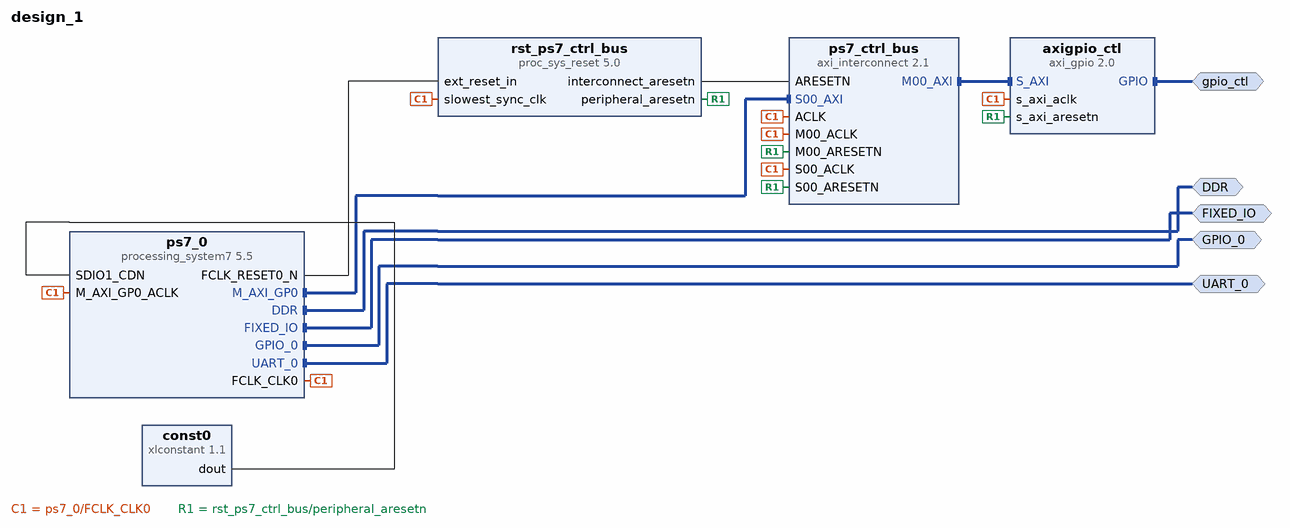
[diagram p0: block diagram of the top level]
# Vivado block design design_1, xc7z010clg400-1, Vivado 2016.4
create_bd_design design_1

create_bd_intf_port -mode Master -vlnv xilinx.com:interface:ddrx_rtl:1.0 DDR
create_bd_intf_port -mode Master -vlnv xilinx.com:display_processing_system7:fixedio_rtl:1.0 FIXED_IO
create_bd_intf_port -mode Master -vlnv xilinx.com:interface:gpio_rtl:1.0 GPIO_0
create_bd_intf_port -mode Master -vlnv xilinx.com:interface:uart_rtl:1.0 UART_0
create_bd_intf_port -mode Master -vlnv xilinx.com:interface:gpio_rtl:1.0 gpio_ctl

create_bd_cell -type ip -vlnv xilinx.com:ip:axi_gpio:2.0 axigpio_ctl
set_property -dict {CONFIG.C_GPIO_WIDTH 2 CONFIG.C_ALL_OUTPUTS 0} [get_bd_cells axigpio_ctl]
create_bd_cell -type ip -vlnv xilinx.com:ip:xlconstant:1.1 const0
set_property -dict {CONFIG.CONST_VAL 0} [get_bd_cells const0]
create_bd_cell -type ip -vlnv xilinx.com:ip:processing_system7:5.5 ps7_0
set_property -dict [list \
  CONFIG.PCW_FPGA0_PERIPHERAL_FREQMHZ 50 \
  CONFIG.PCW_QSPI_GRP_SINGLE_SS_ENABLE 1 \
  CONFIG.PCW_UART0_PERIPHERAL_ENABLE 1 \
  CONFIG.PCW_UART0_UART0_IO EMIO \
  CONFIG.PCW_UART1_PERIPHERAL_ENABLE 1 \
  CONFIG.PCW_UART1_UART1_IO {MIO 8 .. 9} \
  CONFIG.PCW_I2C1_PERIPHERAL_ENABLE 1 \
  CONFIG.PCW_I2C1_I2C1_IO {MIO 48 .. 49} \
  CONFIG.PCW_GPIO_MIO_GPIO_ENABLE 0 \
] [get_bd_cells ps7_0]
# 5 more settings of ps7_0 are not shown: defaults, MIO pin electricals, DDR timing, and values the tool derives
create_bd_cell -type ip -vlnv xilinx.com:ip:axi_interconnect:2.1 ps7_ctrl_bus
set_property -dict {CONFIG.NUM_MI 1} [get_bd_cells ps7_ctrl_bus]
create_bd_cell -type ip -vlnv xilinx.com:ip:proc_sys_reset:5.0 rst_ps7_ctrl_bus

# ---- connections ----

connect_bd_intf_net -intf_net processing_system7_0_M_AXI_GP0 [get_bd_intf_pins ps7_0/M_AXI_GP0] [get_bd_intf_pins ps7_ctrl_bus/S00_AXI]
connect_bd_intf_net [get_bd_intf_pins axigpio_ctl/S_AXI] [get_bd_intf_pins ps7_ctrl_bus/M00_AXI]
connect_bd_intf_net -intf_net processing_system7_1_DDR [get_bd_intf_ports DDR] [get_bd_intf_pins ps7_0/DDR]
connect_bd_intf_net -intf_net processing_system7_1_FIXED_IO [get_bd_intf_ports FIXED_IO] [get_bd_intf_pins ps7_0/FIXED_IO]
connect_bd_intf_net -intf_net processing_system7_0_GPIO_0 [get_bd_intf_ports GPIO_0] [get_bd_intf_pins ps7_0/GPIO_0]
connect_bd_intf_net -intf_net processing_system7_0_UART_0 [get_bd_intf_ports UART_0] [get_bd_intf_pins ps7_0/UART_0]
connect_bd_intf_net -intf_net axi_gpio_0_GPIO [get_bd_intf_ports gpio_ctl] [get_bd_intf_pins axigpio_ctl/GPIO]
connect_bd_net -net processing_system7_0_FCLK_CLK0 [get_bd_pins ps7_0/FCLK_CLK0] \
  [get_bd_pins axigpio_ctl/s_axi_aclk] [get_bd_pins ps7_0/M_AXI_GP0_ACLK] [get_bd_pins ps7_ctrl_bus/ACLK] \
  [get_bd_pins ps7_ctrl_bus/M00_ACLK] [get_bd_pins ps7_ctrl_bus/S00_ACLK] [get_bd_pins rst_ps7_ctrl_bus/slowest_sync_clk]
connect_bd_net -net processing_system7_0_FCLK_RESET0_N [get_bd_pins ps7_0/FCLK_RESET0_N] [get_bd_pins rst_ps7_ctrl_bus/ext_reset_in]
connect_bd_net -net rst_ps7_0_50M_interconnect_aresetn [get_bd_pins rst_ps7_ctrl_bus/interconnect_aresetn] [get_bd_pins ps7_ctrl_bus/ARESETN]
connect_bd_net -net rst_ps7_0_50M_peripheral_aresetn [get_bd_pins rst_ps7_ctrl_bus/peripheral_aresetn] \
  [get_bd_pins axigpio_ctl/s_axi_aresetn] [get_bd_pins ps7_ctrl_bus/M00_ARESETN] [get_bd_pins ps7_ctrl_bus/S00_ARESETN]
connect_bd_net -net xlconstant_0_dout [get_bd_pins const0/dout] [get_bd_pins ps7_0/SDIO1_CDN]

# ---- address map ----
assign_bd_address -offset 0x41200000 -range 64K -target_address_space [get_bd_addr_spaces ps7_0/Data] [get_bd_addr_segs axigpio_ctl/S_AXI/Reg]

validate_bd_design
save_bd_design
